# EAGLE schematic v1 (EAGLE 5.03)
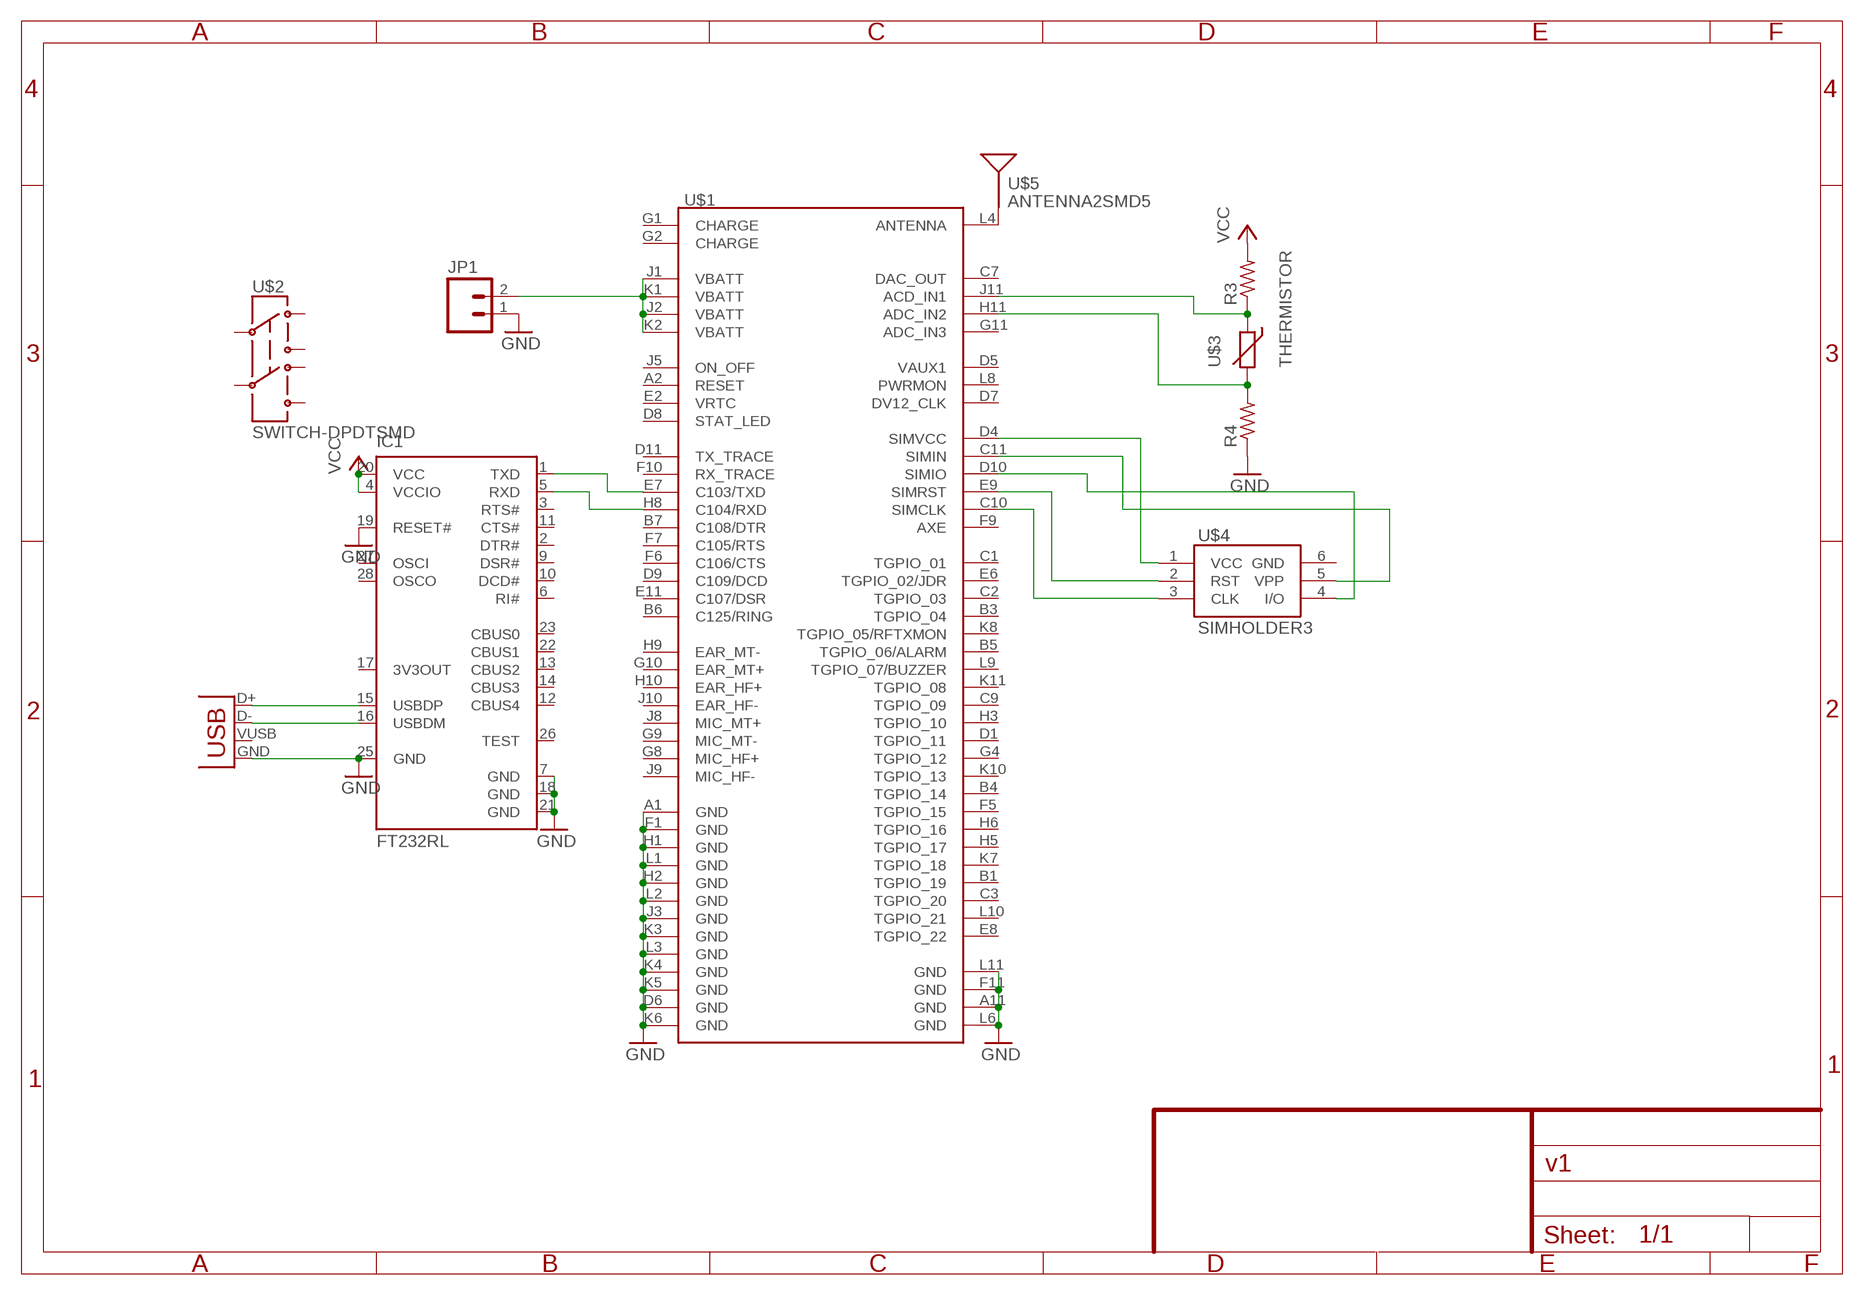
[diagram p0: schematic, sheet 1]

## Parts
IC1  FT232RL  [SSOP28]
JP1  M02-JST-2MM-SMT  [S2B-PH]
R3  R-US_R0603  [R0603]
R4  R-US_R0603  [R0603]
U$1  GE864  [GE864]
U$2  SWITCH-DPDTSMD  [AYZ0202]
U$3  THERMISTOR  [0603]
U$4  SIMHOLDER3  [SIMHOLDER3]
U$5  ANTENNA2SMD5  [ANTENNA-CHIP5]
X2  USB-B-S  [USB-B-SMT]

## Nets
GND: IC1.7(GND) IC1.18(GND) IC1.19(RESET#) IC1.21(GND) IC1.25(GND) JP1.1 R4.1 U$1.A1(GND) U$1.A11(GND) U$1.D6(GND) U$1.F1(GND) U$1.F11(GND) U$1.H1(GND) U$1.H2(GND) U$1.J3(GND) U$1.K3(GND) U$1.K4(GND) U$1.K5(GND) U$1.K6(GND) U$1.L1(GND) U$1.L2(GND) U$1.L3(GND) U$1.L6(GND) U$1.L11(GND) X2.GND
N$1: IC1.1(TXD) U$1.E7(C103/TXD)
N$2: JP1.2 U$1.J1(VBATT) U$1.J2(VBATT) U$1.K1(VBATT) U$1.K2(VBATT)
N$3: IC1.5(RXD) U$1.H8(C104/RXD)
N$4: U$1.D4(SIMVCC) U$4.1(VCC)
N$5: U$1.E9(SIMRST) U$4.2(RST)
N$6: U$1.C10(SIMCLK) U$4.3(CLK)
N$7: U$1.D10(SIMIO) U$4.4(I/O)
N$8: U$1.C11(SIMIN) U$4.5(VPP)
N$9: IC1.15(USBDP) X2.D+
N$10: IC1.16(USBDM) X2.D-
N$11: U$1.L4(ANTENNA) U$5.FEED(SIGNAL)
N$13: R3.1 U$1.J11(ACD_IN1) U$3.1
N$14: R4.2 U$1.H11(ADC_IN2) U$3.2
VCC: IC1.4(VCCIO) IC1.20(VCC) R3.2
Unconnected: IC1.2(DTR#) IC1.3(RTS#) IC1.6(RI#) IC1.9(DSR#) IC1.10(DCD#) IC1.11(CTS#) IC1.12(CBUS4) IC1.13(CBUS2) IC1.14(CBUS3) IC1.17(3V3OUT) IC1.22(CBUS1) IC1.23(CBUS0) IC1.26(TEST) IC1.27(OSCI) IC1.28(OSCO) U$1.A2(RESET) U$1.B1(TGPIO_19) U$1.B3(TGPIO_04) U$1.B4(TGPIO_14) U$1.B5(TGPIO_06/ALARM) U$1.B6(C125/RING) U$1.B7(C108/DTR) U$1.C1(TGPIO_01) U$1.C2(TGPIO_03) U$1.C3(TGPIO_20) U$1.C7(DAC_OUT) U$1.C9(TGPIO_09) U$1.D1(TGPIO_11) U$1.D5(VAUX1) U$1.D7(DV12_CLK) U$1.D8(STAT_LED) U$1.D9(C109/DCD) U$1.D11(TX_TRACE) U$1.E2(VRTC) U$1.E6(TGPIO_02/JDR) U$1.E8(TGPIO_22) U$1.E11(C107/DSR) U$1.F5(TGPIO_15) U$1.F6(C106/CTS) U$1.F7(C105/RTS) U$1.F9(AXE) U$1.F10(RX_TRACE) U$1.G1(CHARGE) U$1.G2(CHARGE) U$1.G4(TGPIO_12) U$1.G8(MIC_HF+) U$1.G9(MIC_MT-) U$1.G10(EAR_MT+) U$1.G11(ADC_IN3) U$1.H3(TGPIO_10) U$1.H5(TGPIO_17) U$1.H6(TGPIO_16) U$1.H9(EAR_MT-) U$1.H10(EAR_HF+) U$1.J5(ON_OFF) U$1.J8(MIC_MT+) U$1.J9(MIC_HF-) U$1.J10(EAR_HF-) U$1.K7(TGPIO_18) U$1.K8(TGPIO_05/RFTXMON) U$1.K10(TGPIO_13) U$1.K11(TGPIO_08) U$1.L8(PWRMON) U$1.L9(TGPIO_07/BUZZER) U$1.L10(TGPIO_21) U$2.1 U$2.2 U$2.3 U$2.4 U$2.5 U$2.6 U$4.6(GND) X2.VUSB(VBUS)

## Library data of the parts
IC1 = ftdichip:FT232R: Source: http://www.ftdichip.com/Documents/DataSheets/DS_FT232R_v104.pdf
JP1 = SparkFun:M02: Header 2 Standard 2-pin 0.1" header. Use with straight break away headers (SKU : PRT-00116), right angle break away headers (PRT-00553), swiss pins (PRT-00743), machine pins (PRT-00117), and female headers (PRT-00115). Molex polarized connector foot print use with SKU : PRT-08233 with associated crimp pins and housings.
R3 R4 = rcl:R-US_: RESISTOR, American symbol
U$1 = SparkFun:GE864
U$2 = SparkFun:SWITCH-DPDT: DPDT Version of the COM-00597, MSS22 is a 125VAC @ 300mA rated switch
U$3 = nublabs:THERMISTOR
U$4 = SparkFun:SIMHOLDER3
U$5 = SparkFun:ANTENNA2: Antenna Single endded antenna. Common with smaller chip antennas. CHIP4 package is the GPS Chip Antenna SKU: GPS-08418. CHIP5 package is 2.4GHz chip antenna SKU: WRL-00144.
X2 = SparkFun:USB: USB Connectors USB-B-PTH is fully proven SKU : PRT-00139 USB-miniB is fully proven SKU : PRT-00587 USB-A-PCB is untested. USB-A-H is throughly reviewed, but untested. Spark Fun Electronics SKU : PRT-00437 USB-B-SMT is throughly reviewed, but untested. Needs silkscreen touching up. USB-A-S has not been used/tested USB-MB-H has not been used/tested